# EAGLE design sound_gps (EAGLE 7.7.0)
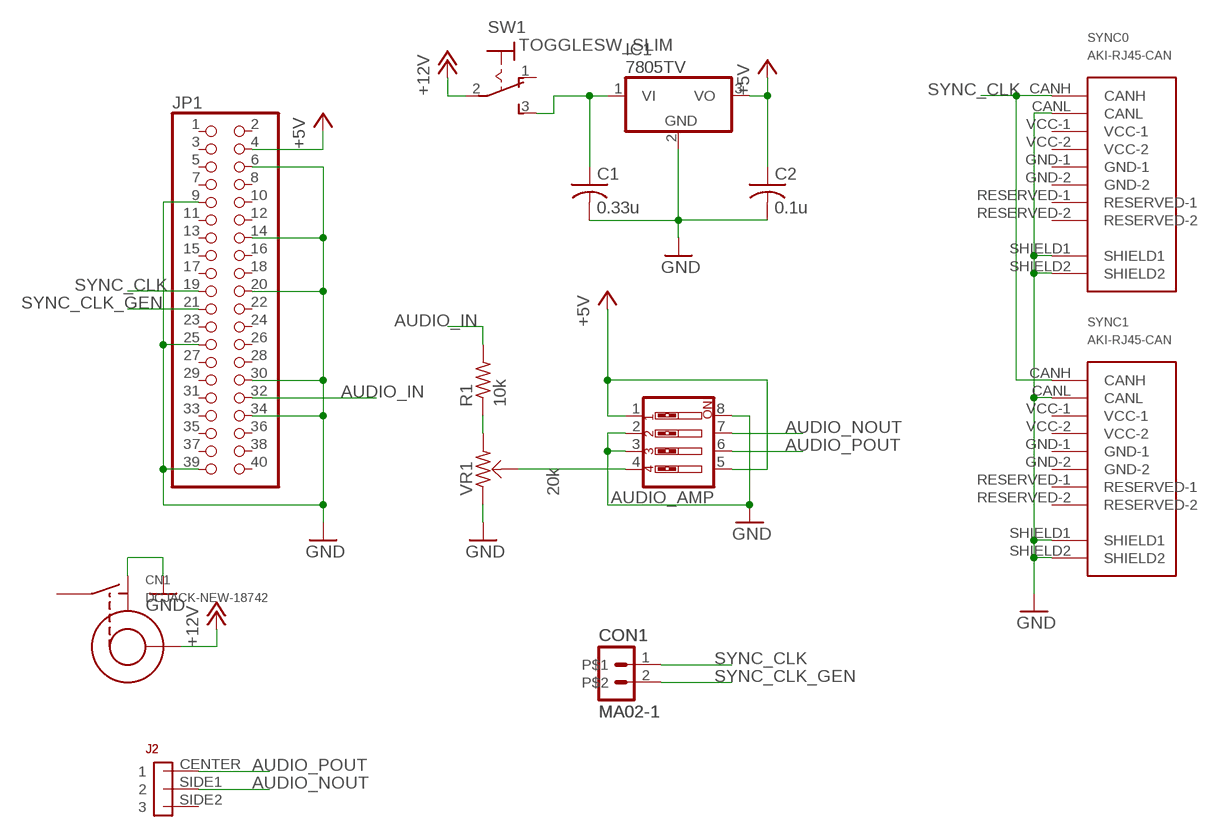
[diagram p0: schematic, sheet 1]

## Parts
AUDIO_AMP  SW_DIP-4  [EDG-04]
C1  0.33u  C-2012  [2012-C]
C2  0.1u  C-2012  [2012-C]
CN1  DCJACK-NEW-18742  [18742]
CON1  MA02-1  [MA02-1]
IC1  7805TV  [TO220V]
J2  DCJACK  [DCJACK]
JP1  PINHD-2X20  [2X20]
R1  10k  R-1608  [1608]
SW1  TOGGLESW_SLIM  [TOGGLESW_SLIM]
SYNC0  AKI-RJ45-CAN  [AKI-RJ45-CAN]
SYNC1  AKI-RJ45-CAN  [AKI-RJ45-CAN]
VR1  20k  VR  [VR-637A]

## Nets
+5V: AUDIO_AMP.1 AUDIO_AMP.5 C2.1 IC1.3(VO) JP1.4
+12V: CN1.P$1(CENTER) SW1.2(P)
AUDIO_IN: JP1.32 R1.2
AUDIO_NOUT: AUDIO_AMP.7 J2.SIDE1
AUDIO_POUT: AUDIO_AMP.6 J2.CENTER
GND: AUDIO_AMP.2 AUDIO_AMP.3 AUDIO_AMP.8 C1.2 C2.2 CN1.P$2(TIP) IC1.2(GND) JP1.6 JP1.9 JP1.14 JP1.20 JP1.25 JP1.30 JP1.34 JP1.39 SYNC0.CANL SYNC0.SHIELD1 SYNC0.SHIELD2 SYNC1.CANL SYNC1.SHIELD1 SYNC1.SHIELD2 VR1.1
N$1: AUDIO_AMP.4 VR1.BR
N$2: R1.1 VR1.2
N$3: C1.1 IC1.1(VI) SW1.3(S)
SYNC_CLK: CON1.1 JP1.19 SYNC0.CANH SYNC1.CANH
SYNC_CLK_GEN: CON1.2 JP1.21
Unconnected: CN1.P$3(SHUNT) J2.SIDE2 JP1.1 JP1.2 JP1.3 JP1.5 JP1.7 JP1.8 JP1.10 JP1.11 JP1.12 JP1.13 JP1.15 JP1.16 JP1.17 JP1.18 JP1.22 JP1.23 JP1.24 JP1.26 JP1.27 JP1.28 JP1.29 JP1.31 JP1.33 JP1.35 JP1.36 JP1.37 JP1.38 JP1.40 SW1.1(O) SYNC0.RESERVED-1 SYNC0.RESERVED-2 SYNC1.RESERVED-1 SYNC1.RESERVED-2

## Power pins joined to a net without a drawn wire
GND-1: SYNC0.GND-1 SYNC1.GND-1
GND-2: SYNC0.GND-2 SYNC1.GND-2
VCC-1: SYNC0.VCC-1 SYNC1.VCC-1
VCC-2: SYNC0.VCC-2 SYNC1.VCC-2

## Library data of the parts
AUDIO_AMP = special:SW_DIP-4: DIP SWITCH
C1 C2 = Passive_Robotech:C
CN1 = Connector_Robotech:DCJACK-NEW
CON1 = Connector_Robotech:MA02-1: Jumper Pin Header
IC1 = linear:78*: Positive VOLTAGE REGULATOR Source: http://cache.national.com/ds/LM/LM78L05.pdf http://www.fairchildsemi.com/ds/LM/LM7805.pdf
J2 = Connector_Robotech:DCJACK
JP1 = pinhead:PINHD-2X20: PIN HEADER
R1 = Passive_Robotech:R
SW1 = Passive_Robotech:TOGGLESW_SLIM: 3-pin Toggle Switch sold in akidzuki @ 80yen (2008/04/09)
SYNC0 SYNC1 = Connector_Robotech:AKI-RJ45-CAN: Akizuki RJ-45 connector for CAN
VR1 = Passive_Robotech:VR

## Board
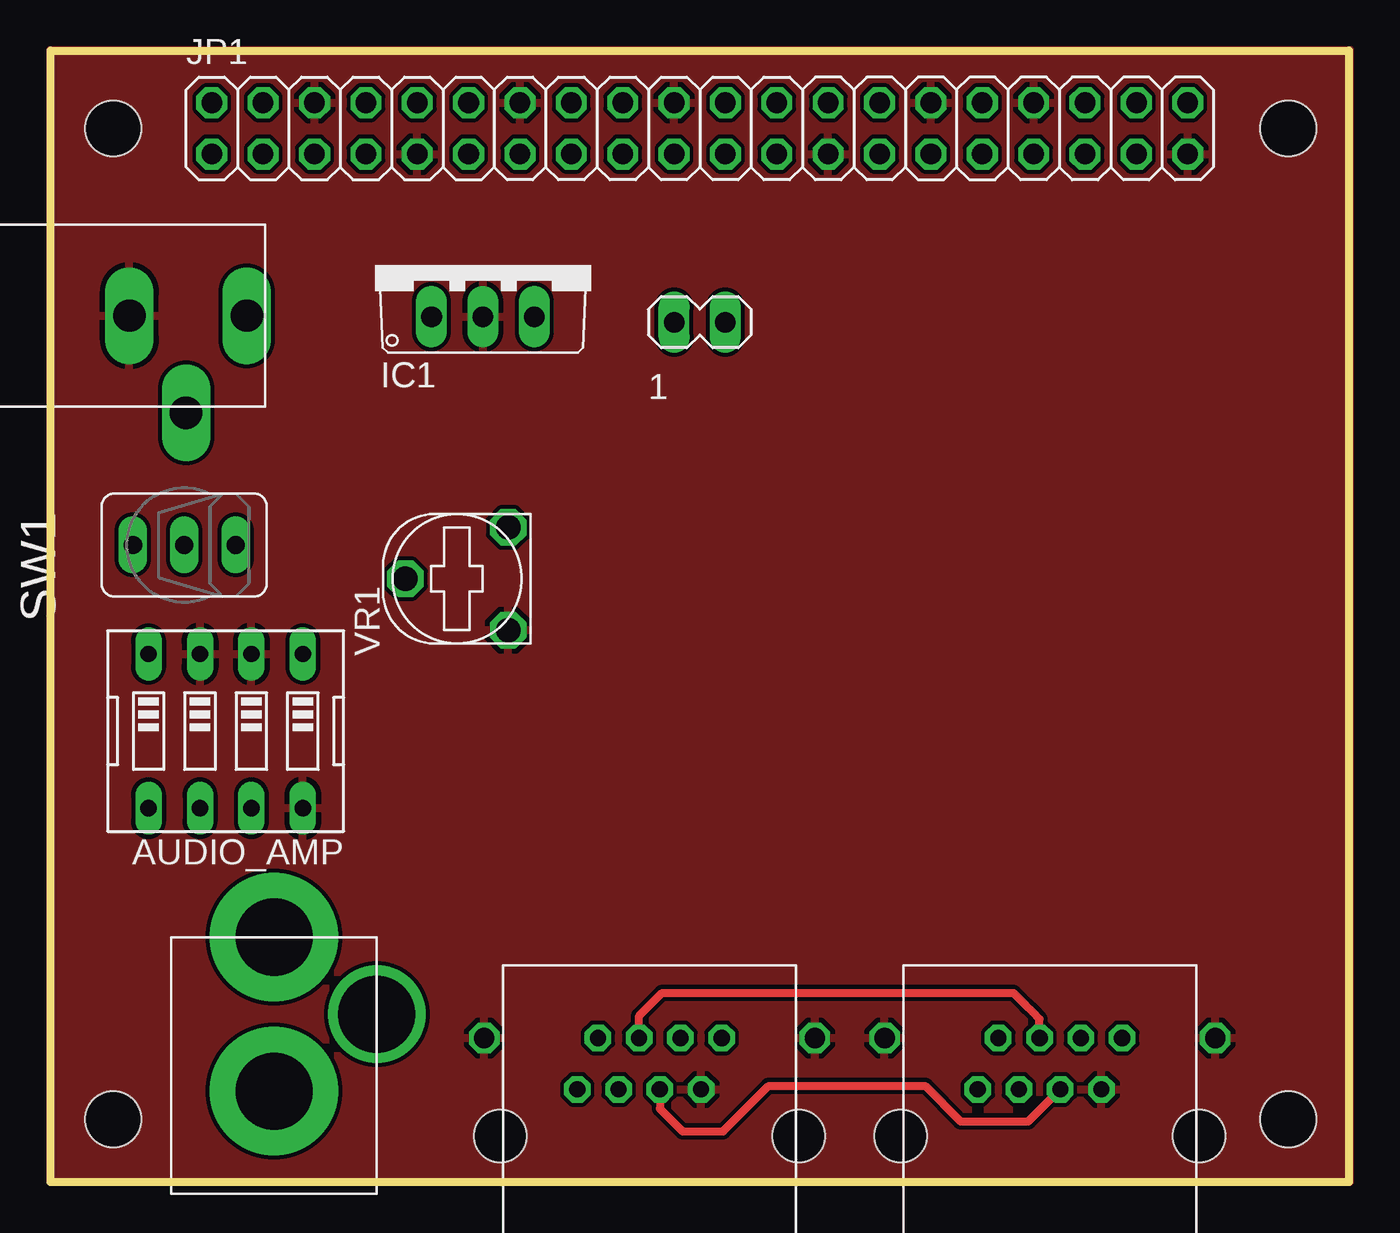
[diagram p1: board, top side]
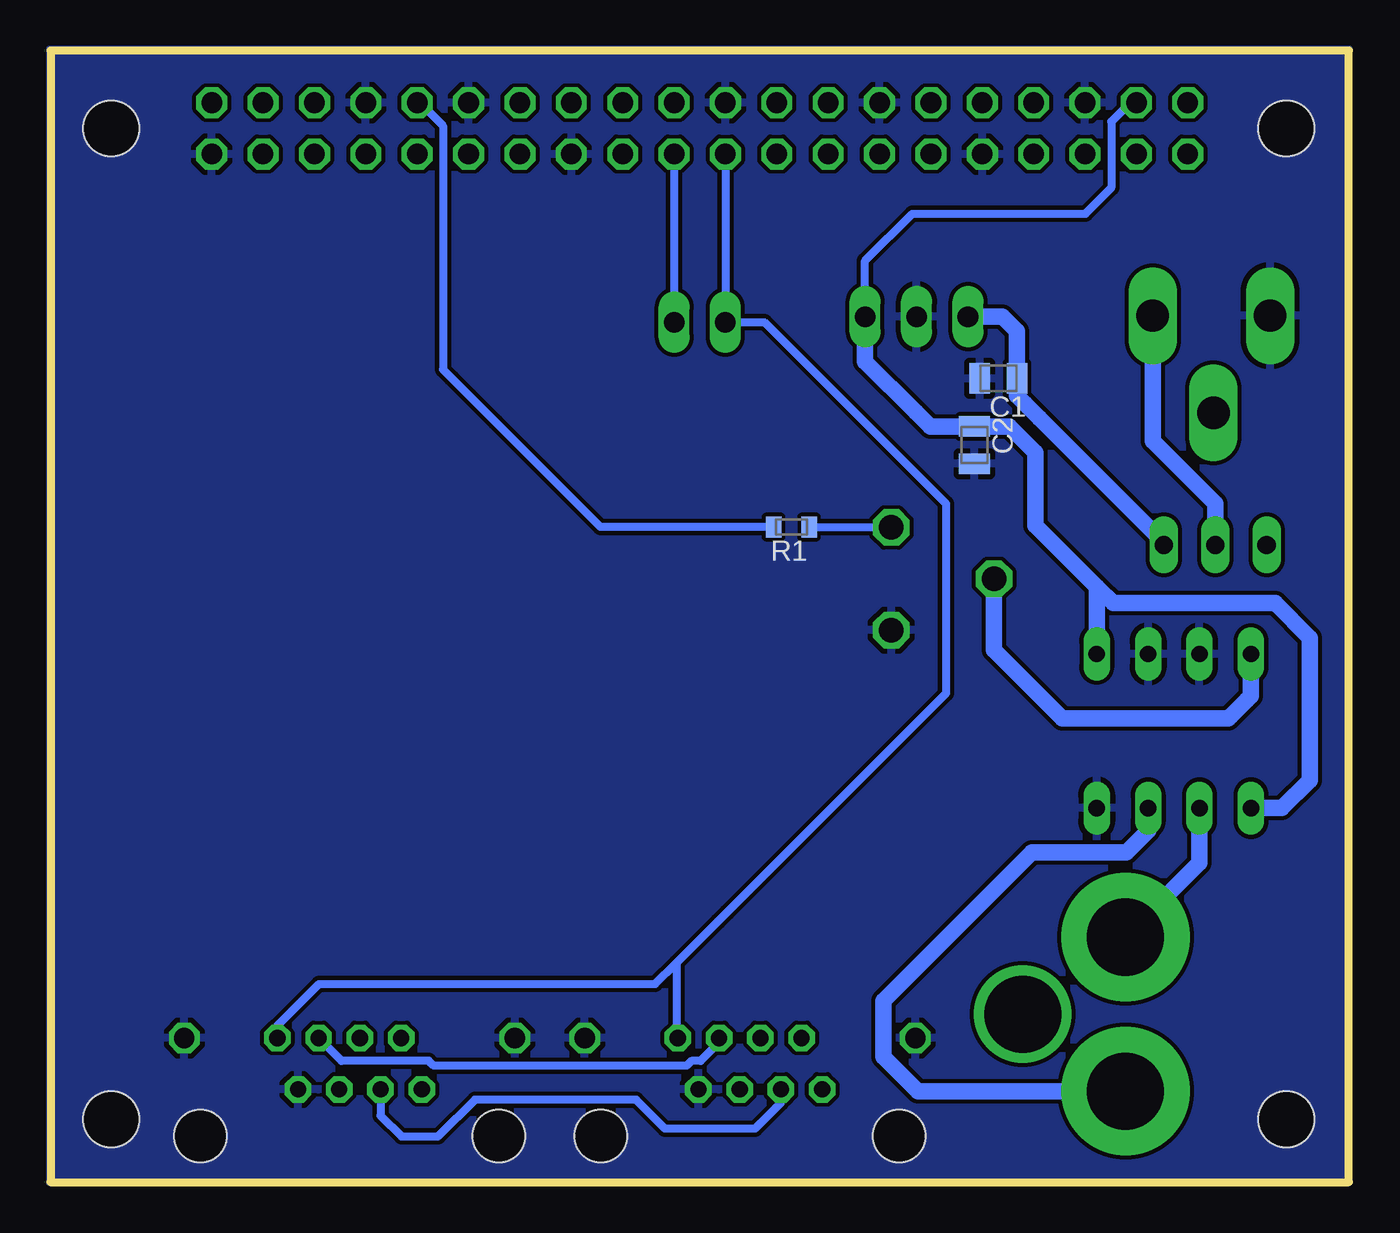
[diagram p2: board, bottom side, seen from below]

Size 64.2 x 55.95 mm. Coordinates in mm from the lower left corner, seen from the top.
Outline: 0,55.95 64.2,55.95 64.2,0 0,0 0,55.95
Copper layers (1*16): Top 0.0356mm / dielectric 1.5011mm / Bottom 0.0356mm
Design rules "formitaminimum": minimum track width 5mil, minimum drill 0.5994mm, track to track 0.2007mm, track to pad 0.2007mm, pad to pad 0.2007mm, via to via 0.2007mm, smd to smd 0mil, copper to edge 0mil, drill to drill 1mil, minimum pad ring 10mil, minimum via ring 8mil, stop-mask expansion 4mil, vias tented up to drill 0mil, thermal gap 10mil
Holes 2.75 mm at 3.1,52.1 3.1,3.1 61.2,52.1 61.2,3.1

### Footprints (pad centres in the part's own frame; a part is rotated, then mirrored left to right if it is on the bottom)
EDG-04 = drill 0.813 long: 1 -3.81,-3.81; 2 -1.27,-3.81; 3 1.27,-3.81; 4 3.81,-3.81; 5 3.81,3.81; 6 1.27,3.81; 7 -1.27,3.81; 8 -3.81,3.81
2012-C = smd 1.016 x 1.524: 1 -0.921,0; 2 0.921,0
18742 = drill 1.6 long: P$1 5.8,0; P$2 0,0; P$3 2.8,-4.8
MA02-1 = drill 1.016 long: 1 -1.27,0; 2 1.27,0
TO220V = drill 1.016 long: 1 -2.54,-2.54; 2 0,-2.54; 3 2.54,-2.54
DCJACK = drill 3.81 pad 6.35: CENTER 5.08,0; SIDE1 -2.54,0 | drill 3.81: SIDE2 1.27,-5.08
2X20 = drill 1.016 octagon: 1 -24.13,-1.27; 2 -24.13,1.27; 3 -21.59,-1.27; 4 -21.59,1.27; 5 -19.05,-1.27; 6 -19.05,1.27; 7 -16.51,-1.27; 8 -16.51,1.27; 9 -13.97,-1.27; 10 -13.97,1.27; 11 -11.43,-1.27; 12 -11.43,1.27; 13 -8.89,-1.27; 14 -8.89,1.27; 15 -6.35,-1.27; 16 -6.35,1.27; 17 -3.81,-1.27; 18 -3.81,1.27; 19 -1.27,-1.27; 20 -1.27,1.27; 21 1.27,-1.27; 22 1.27,1.27; 23 3.81,-1.27; 24 3.81,1.27; 25 6.35,-1.27; 26 6.35,1.27; 27 8.89,-1.27; 28 8.89,1.27; 29 11.43,-1.27; 30 11.43,1.27; 31 13.97,-1.27; 32 13.97,1.27; 33 16.51,-1.27; 34 16.51,1.27; 35 19.05,-1.27; 36 19.05,1.27; 37 21.59,-1.27; 38 21.59,1.27; 39 24.13,-1.27; 40 24.13,1.27
1608 = smd 0.762 x 1.016: 1 -0.875,0; 2 0.875,0
TOGGLESW_SLIM = drill 0.9 long: 1 0,2.54; 2 0,0; 3 0,-2.54
AKI-RJ45-CAN = drill 0.8 octagon: CANH 3.695,2.54; CANL 2.675,0; GND-1 -0.385,2.54; GND-2 -1.405,0; RESERVED-1 -2.425,2.54; RESERVED-2 -3.445,0; VCC-1 1.655,2.54; VCC-2 0.635,0 | drill 1 octagon: SHIELD1 -8.05,2.54; SHIELD2 8.3,2.54 | hole 2.6: 7.5,-2.3; -7.25,-2.3
VR-637A = drill 1.2 octagon: 1 -2.54,-2.54; 2 2.54,-2.54; BR 0,2.54

### Placement (x,y rotation side)
AUDIO_AMP  8.66,22.3 180 top
C1  17.33,39.74 180 bottom
C2  18.52,36.44 270 bottom
CN1  3.9,42.84 0 top
CON1  32.1,42.52 0 top
IC1  21.38,45.33 0 top
J2  11.05,7.03 90 top
JP1  32.1,52.1 0 top
R1  27.57,32.39 180 bottom
SW1  6.61,31.5 90 top
SYNC0  29.49,4.58 0 top
SYNC1  49.29,4.58 0 top
VR1  20.09,29.83 90 top

### Tracks (layer width: path | path; a pad name or v marks a point on that pad's centre or on a via)
+5V
  Bottom 0.406: JP1.4 10.82,53.37 11.75,52.44 11.75,49.16 13.03,47.88 21.59,47.88 23.92,45.55 IC1.3
  Bottom 0.813: 18.59,37.43 C2.1 | C2.1 16.8,37.36 15.51,36.07 15.51,32.47 12.47,29.43 | 12.47,29.43 11.66,28.62 3.65,28.62 1.94,26.91 1.94,19.86 3.31,18.49 AUDIO_AMP.5 | AUDIO_AMP.1 12.47,29.43 | IC1.3 23.92,40.58 21.41,38.08 20.71,37.37 20.7,37.36 C2.1
+12V
  Bottom 0.813: SW1.2 6.61,33.54 9.7,36.63 CN1.P$1
AUDIO_IN
  Bottom 0.406: JP1.32 45.93,53.36 44.8,52.23 44.8,40.18 44.37,39.75 42.19,37.57 37.01,32.39 R1.2
AUDIO_NOUT
  Bottom 0.813: AUDIO_AMP.7 9.93,17.38 11.01,16.3 15.68,16.3 23.02,8.96 23.02,6.19 21.32,4.49 J2.SIDE1
AUDIO_POUT
  Bottom 0.813: AUDIO_AMP.6 7.39,15.77 J2.CENTER
GND
  pour Bottom: 0,56 64.25,56 64.25,0 0,0
  pour Top: 0,56 64.25,56 64.25,0 0,0
GND-1
  Top 0.406: SYNC0.GND-1 29.11,8.21 30.24,9.35 47.62,9.35 48.2,8.77 48.56,8.41 48.91,8.06 SYNC1.GND-1
GND-2
  Bottom 0.406: SYNC0.GND-2 28.09,3.92 29.36,2.64 33.82,2.64 35.25,4.07 43.22,4.07 45.04,2.25 46.85,2.25 47.88,3.29 SYNC1.GND-2
N$1
  Bottom 0.813: VR1.BR 17.55,26.31 14.17,22.93 5.96,22.93 5.84,23.05 5.05,23.84 4.85,24.04 AUDIO_AMP.4
N$2
  Bottom 0.406: R1.1 22.65,32.39 VR1.2
N$3
  Bottom 0.813: IC1.1 17.13,42.79 16.41,42.07 C1.1 16.41,38.88 16.02,38.49 15.3,37.77 9.15,31.62 SW1.3
SYNC_CLK
  Bottom 0.406: JP1.19 CON1.1 28.9,42.52 19.92,33.54 19.92,24.17 30.75,13.34 31.2,12.89 33.26,10.83 | 33.26,10.83 33.26,7.2 SYNC0.CANH | SYNC1.CANH 52.98,7.74 50.93,9.79 34.3,9.79 33.26,10.83
SYNC_CLK_GEN
  Bottom 0.406: JP1.21 33.37,43.29 33.37,42.76 CON1.2
VCC-1
  Bottom 0.406: SYNC0.VCC-1 31.14,6.91 32.06,5.99 32.51,5.99 32.75,5.75 45.25,5.75 45.5,6 49.8,6 49.81,5.99 SYNC1.VCC-1
VCC-2
  Top 0.406: SYNC0.VCC-2 30.12,3.62 31.25,2.5 33.25,2.5 35.5,4.75 43.25,4.75 45,3 48.34,3 SYNC1.VCC-2